# EAGLE design ArduinoUhr1 (EAGLE 9.0.0)
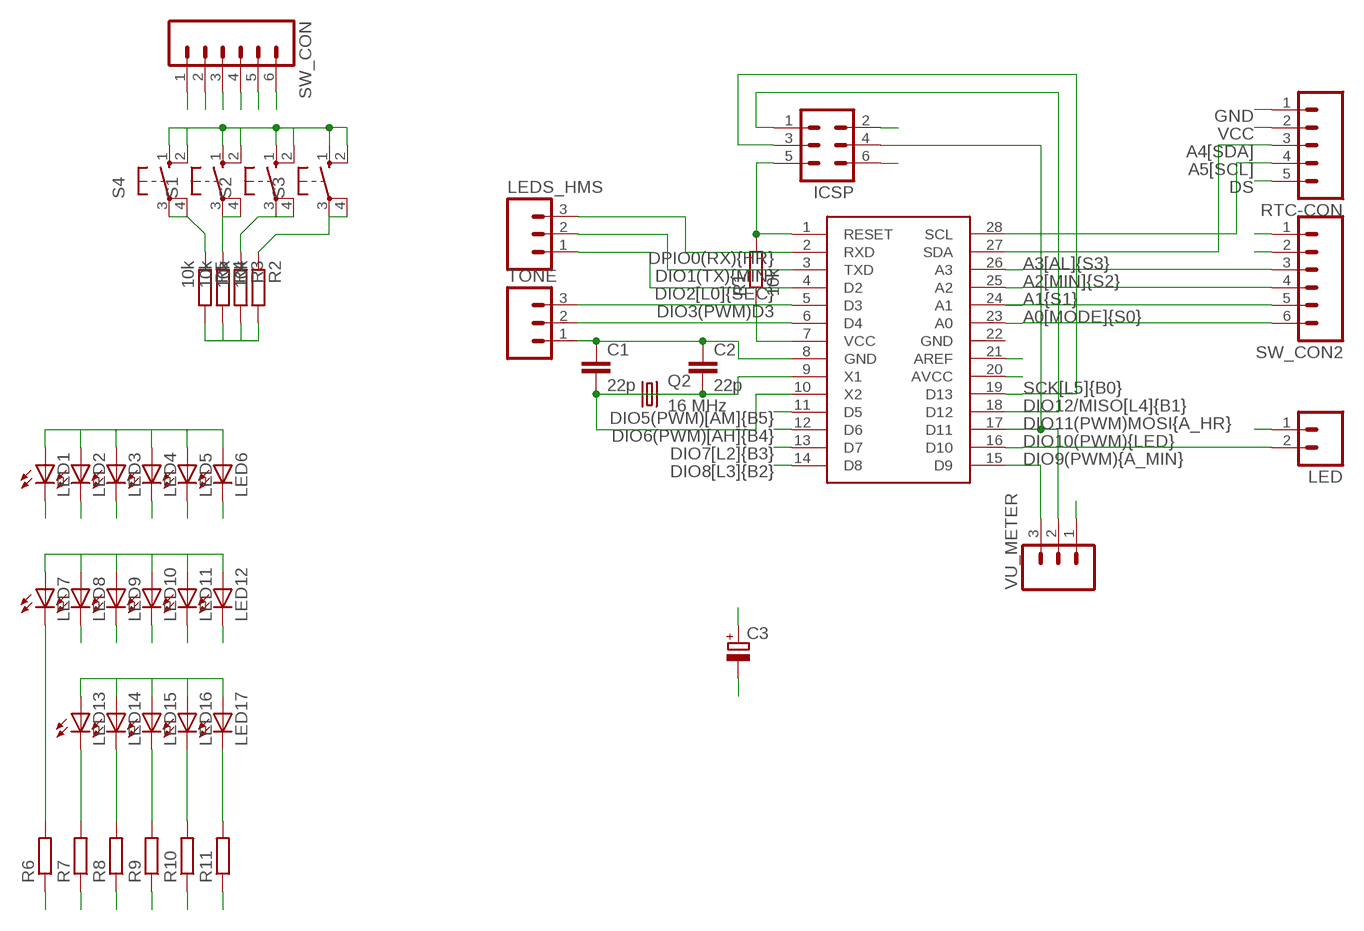
[diagram p0: schematic, sheet 1]

## Parts
C1  22p  C-EU025-024X044  [C025-024X044]
C2  22p  C-EU025-024X044  [C025-024X044]
C3  CPOL-EUE5-10.5  [E5-10,5]
ICSP  MA03-2  [MA03-2]
LED  M02  [02P]
LED1  LED3MM  [LED3MM]
LED2  LED3MM  [LED3MM]
LED3  LED3MM  [LED3MM]
LED4  LED3MM  [LED3MM]
LED5  LED3MM  [LED3MM]
LED6  LED3MM  [LED3MM]
LED7  LED3MM  [LED3MM]
LED8  LED3MM  [LED3MM]
LED9  LED3MM  [LED3MM]
LED10  LED3MM  [LED3MM]
LED11  LED3MM  [LED3MM]
LED12  LED3MM  [LED3MM]
LED13  LED5MM  [LED5MM]
LED14  LED5MM  [LED5MM]
LED15  LED5MM  [LED5MM]
LED16  LED5MM  [LED5MM]
LED17  LED5MM  [LED5MM]
LEDS_HMS  M03  [03P]
Q2  16 MHz  CRYSTALHC49S  [HC49/S]
R1  10k  R-EU_0207/15  [0207/15]
R2  10k  R-EU_0204/5  [0204/5]
R3  10k  R-EU_0204/5  [0204/5]
R4  10k  R-EU_0204/5  [0204/5]
R5  10k  R-EU_0204/5  [0204/5]
R6  R-EU_0204/7  [0204/7]
R7  R-EU_0204/7  [0204/7]
R8  R-EU_0204/7  [0204/7]
R9  R-EU_0204/7  [0204/7]
R10  R-EU_0204/7  [0204/7]
R11  R-EU_0204/7  [0204/7]
RTC-CON  M05  [05P]
S1  40-XX  [B3F-40XX]
S2  40-XX  [B3F-40XX]
S3  40-XX  [B3F-40XX]
S4  40-XX  [B3F-40XX]
SW_CON  M06  [06P]
SW_CON2  M06  [06P]
TONE  M03  [03P]
U$1  ATMEGA328P-PU  [DIL28-3]
VU_METER  M03  [03P]

## Nets
A0[MODE]{S0}: SW_CON2.6 U$1.23(A0)
A1{S1}: SW_CON2.5 U$1.24(A1)
A2[MIN]{S2}: SW_CON2.4 U$1.25(A2)
A3[AL]{S3}: SW_CON2.3 U$1.26(A3)
A4[SDA]: RTC-CON.3 U$1.27(SDA)
A5[SCL]: RTC-CON.4 U$1.28(SCL)
AREF: U$1.21(AREF)
BIT0: R11.1
BIT1: R10.1
BIT2: R9.1
BIT3: R8.1
BIT4: R7.1
BIT5: R6.1
D4: TONE.2 U$1.6(D4)
DIO1(TX){MIN}: LED7.A LED8.A LED9.A LED10.A LED11.A LED12.A LEDS_HMS.2 U$1.3(TXD)
DIO2[L0]{SEC}: LED1.A LED2.A LED3.A LED4.A LED5.A LED6.A LEDS_HMS.1 U$1.4(D2)
DIO3(PWM)D3: TONE.3 U$1.5(D3)
DIO5(PWM)[AM]{B5}: U$1.11(D5)
DIO6(PWM)[AH]{B4}: U$1.12(D6)
DIO7[L2]{B3}: U$1.13(D7)
DIO8[L3]{B2}: U$1.14(D8)
DIO9(PWM){A_MIN}: U$1.15(D9) VU_METER.3
DIO10(PWM){LED}: LED.2 U$1.16(D10)
DIO11(PWM)MOSI{A_HR}: ICSP.4 U$1.17(D11) VU_METER.2
DIO12/MISO[L4]{B1}: ICSP.1 U$1.18(D12)
DPIO0(RX){HR}: LED13.A LED14.A LED15.A LED16.A LED17.A LEDS_HMS.3 U$1.2(RXD)
DS: RTC-CON.5
GND: C1.1 C2.1 C3.- ICSP.6 LED.1 RTC-CON.1 SW_CON2.2 TONE.1 U$1.8(GND) VU_METER.1
GND_SW: R2.2 R3.2 R4.2 R5.2 SW_CON.2
LED0: LED6.K(C) LED12.K(C) LED17.K(C) R11.2
LED1: LED5.K(C) LED11.K(C) LED16.K(C) R10.2
LED2: LED4.K(C) LED10.K(C) LED15.K(C) R9.2
LED3: LED3.K(C) LED9.K(C) LED14.K(C) R8.2
LED4: LED2.K(C) LED8.K(C) LED13.K(C) R7.2
LED5: LED1.K(C) LED7.K(C) R6.2
RESET: ICSP.5 R1.2 U$1.1(RESET)
SCK[L5]{B0}: ICSP.3 U$1.19(D13)
SW1: R5.1 S4.3(P) S4.4(P1) SW_CON.3
SW2: R4.1 S1.3(P) S1.4(P1) SW_CON.4
SW3: R3.1 S2.3(P) S2.4(P1) SW_CON.5
SW4: R2.1 S3.3(P) S3.4(P1) SW_CON.6
VCC: C3.+ ICSP.2 R1.1 RTC-CON.2 SW_CON2.1 U$1.7(VCC) U$1.20(AVCC)
VCC_SW: S1.1(S) S1.2(S1) S2.1(S) S2.2(S1) S3.1(S) S3.2(S1) S4.1(S) S4.2(S1) SW_CON.1
X1: C2.2 Q2.1 U$1.9(X1)
X2: C1.2 Q2.2 U$1.10(X2)
Unconnected: U$1.22(GND)

## Library data of the parts
C1 C2 = rcl:C-EU: CAPACITOR, European symbol
C3 = rcl:CPOL-EU: POLARIZED CAPACITOR, European symbol
ICSP = con-lstb:MA03-2: PIN HEADER; OC_FARNELL: unknown; OC_NEWARK: unknown
LED = con-amp-quick:M02: AMP QUICK CONNECTOR; OC_FARNELL: unknown; OC_NEWARK: unknown
LED1-LED17 = led:LED: LED OSRAM: - CHIPLED LG R971, LG N971, LY N971, LG Q971, LY Q971, LO R971, LY R971 LH N974, LH R974 LS Q976, LO Q976, LY Q976 LO Q996 - Hyper CHIPLED LW Q18S LB Q993, LB Q99A, LB R99A - SideLED LS A670, LO A670, LY A670, LG A670, LP A670 LB A673, LV A673, LT A673, LW A673 LH A674 LY A675 LS A676, LA A676, LO A676, LY A676, LW A676 LS A679, LY A679, LG A679 - Hyper Micro SIDELED® LS Y876, LA Y876, LO Y876, LY Y876 LT Y87S - SmartLED LW L88C, LW L88S LB L89C, LB L89S, LG L890 LS L89K, LO L89K, LY L89K LS L896, LA L896, LO L896, LY L896 - TOPLED LS T670, LO T670, LY T670, LG T670, LP T670 LSG T670, LSP T670, LSY T670, LOP T670, LYG T670 LG T671, LOG T671, LSG T671 LB T673, LV T673, LT T673, LW T673 LH T674 LS T676, LA T676, LO T676, LY T676, LB T676, LH T676, LSB T676, LW T676 LB T67C, LV T67C, LT T67C, LS T67K, LO T67K, LY T67K, LW E67C LS E67B, LA E67B, LO E67B, LY E67B, LB E67C, LV E67C, LT E67C LW T67C LS T679, LY T679, LG T679 LS T770, LO T770, LY T770, LG T770, LP T770 LB T773, LV T773, LT T773, LW T773 LH T774 LS E675, LA E675, LY E675, LS T675 LS T776, LA T776, LO T776, LY T776, LB T776 LHGB T686 LT T68C, LB T68C - Hyper Mini TOPLED® LB M676 - Mini TOPLED Santana® LG M470 LS M47K, LO M47K, LY M47K Source: http://www.osram.convergy.de LUXEON: - LUMILED® LXK2-PW12-R00, LXK2-PW12-S00, LXK2-PW14-U00, LXK2-PW14-V00 LXK2-PM12-R00, LXK2-PM12-S00, LXK2-PM14-U00 LXK2-PE12-Q00, LXK2-PE12-R00, LXK2-PE12-S00, LXK2-PE14-T00, LXK2-PE14-U00 LXK2-PB12-K00, LXK2-PB12-L00, LXK2-PB12-M00, LXK2-PB14-N00, LXK2-PB14-P00, LXK2-PB14-Q00 LXK2-PR12-L00, LXK2-PR12-M00, LXK2-PR14-Q00, LXK2-PR14-R00 LXK2-PD12-Q00, LXK2-PD12-R00, LXK2-PD12-S00 LXK2-PH12-R00, LXK2-PH12-S00 LXK2-PL12-P00, LXK2-PL12-Q00, LXK2-PL12-R00 Source: www.luxeon.com KINGBRIGHT: KA-3528ASYC Source: www.kingbright.com
LEDS_HMS TONE VU_METER = con-amp-quick:M03: AMP QUICK CONNECTOR; OC_FARNELL: unknown; OC_NEWARK: unknown
Q2 = crystal:CRYSTAL: CRYSTAL; OC_FARNELL: 1667008; OC_NEWARK: unknown
R1-R11 = rcl:R-EU_: RESISTOR, European symbol
RTC-CON = con-amp-quick:M05: AMP QUICK CONNECTOR; OC_FARNELL: unknown; OC_NEWARK: unknown
S1-S4 = switch-omron:40-XX: OMRON SWITCH; MF: OMRON COMPONENTS USA; MPN: B3F-4000; OC_FARNELL: 176434; OC_NEWARK: 36K3105
SW_CON SW_CON2 = con-amp-quick:M06: AMP QUICK CONNECTOR; OC_FARNELL: unknown; OC_NEWARK: unknown
U$1 = atmel2:ATMEGA328P-PU

## Board
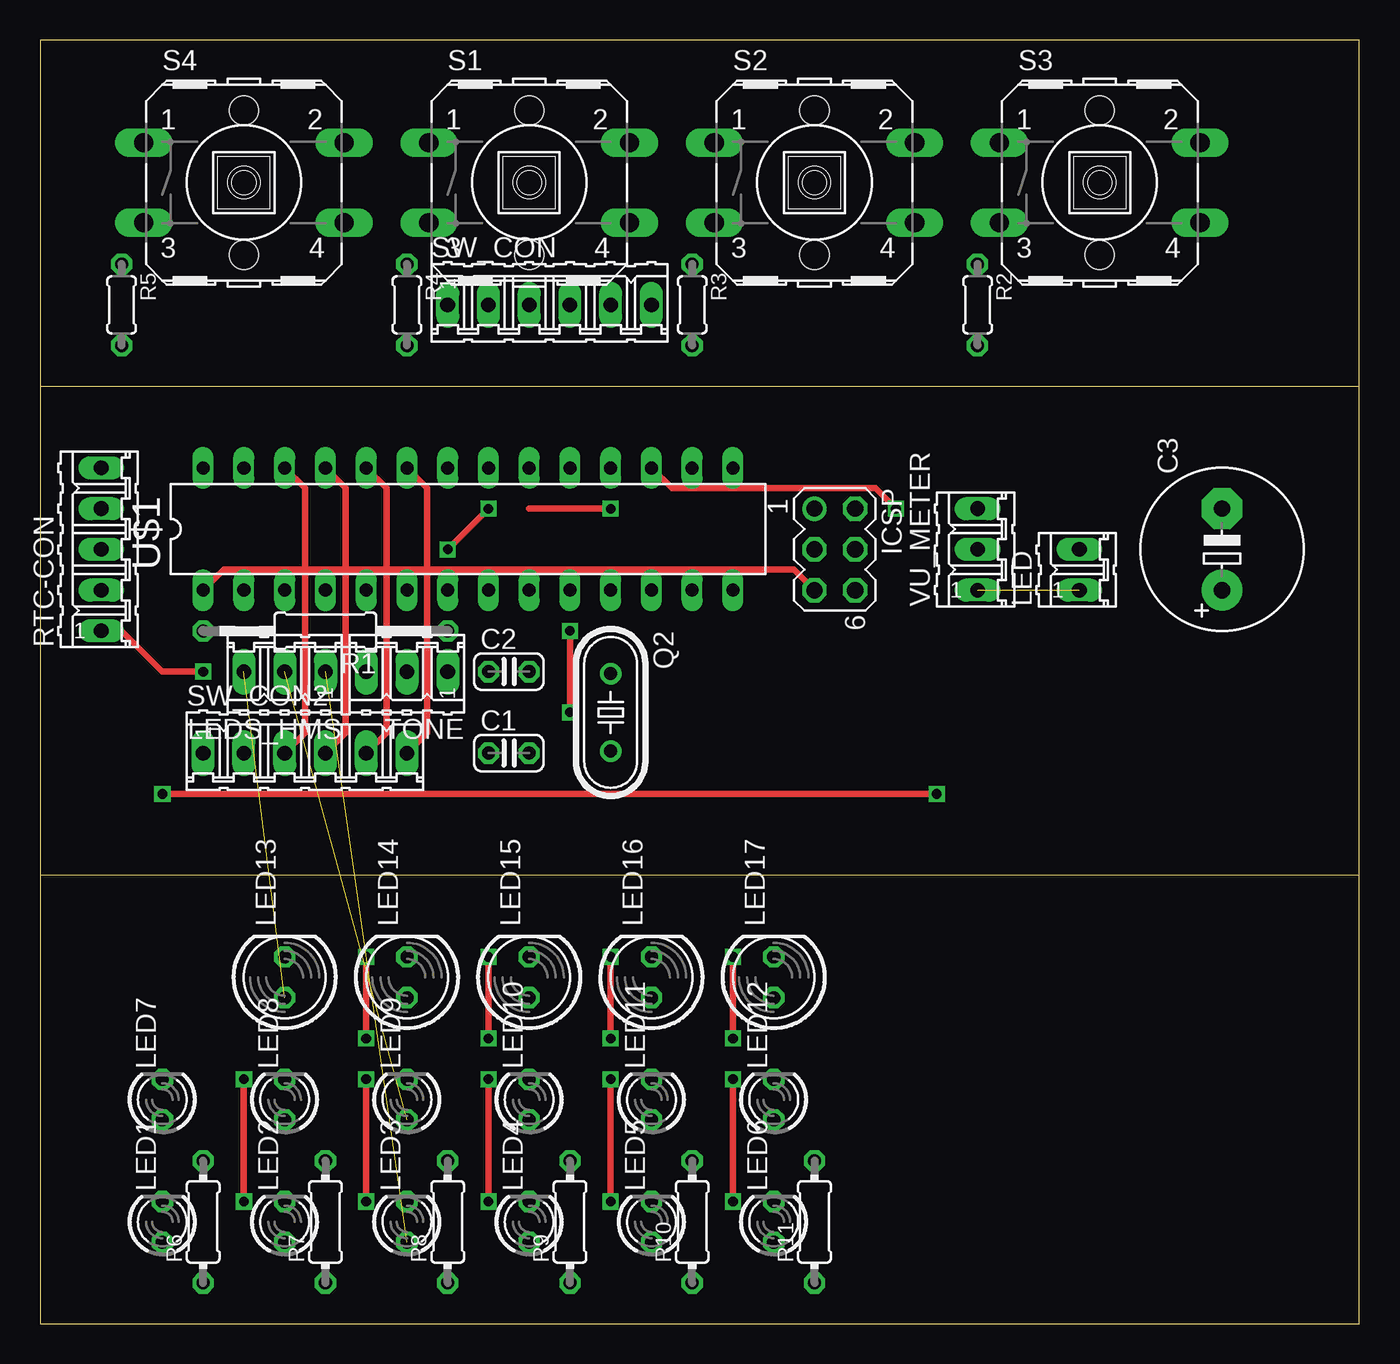
[diagram p1: board, top side]
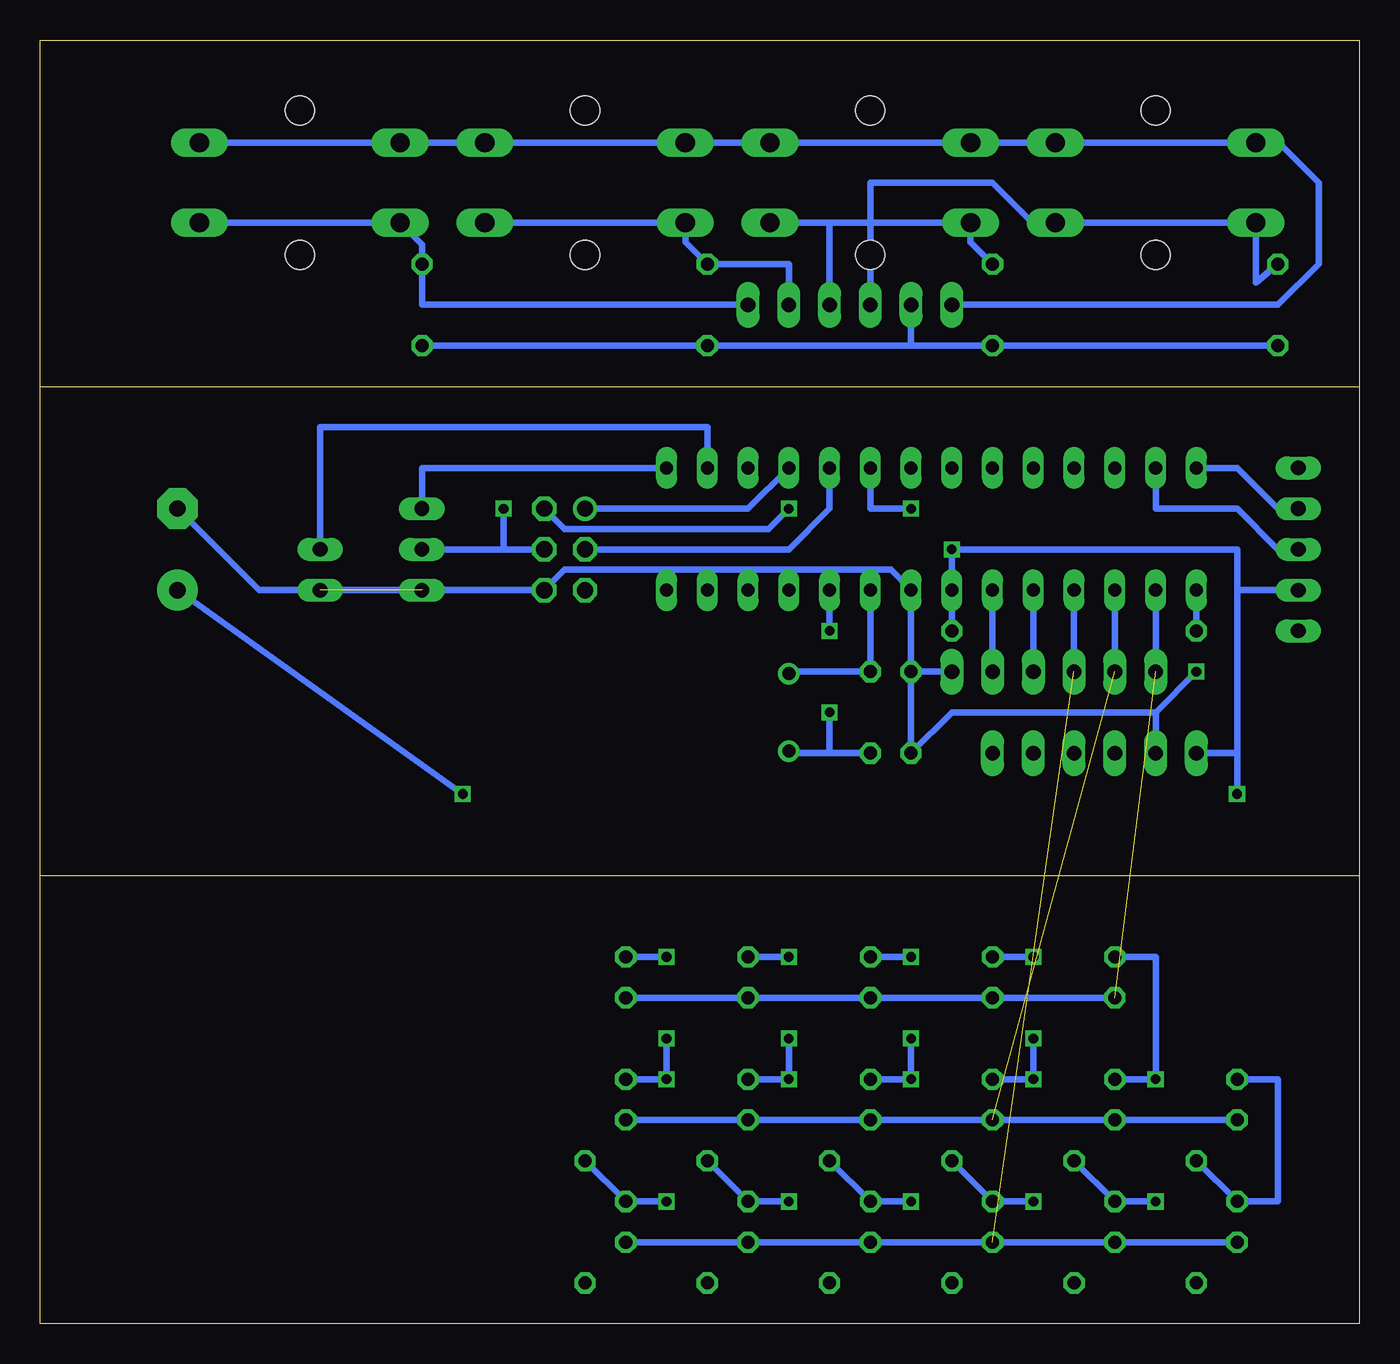
[diagram p2: board, bottom side, seen from below]

Size 82.22 x 80 mm. Coordinates in mm from the lower left corner, seen from the top.
Outline: 82.22,27.93 82.22,0 0,0 0,27.93
Outline: 82.22,27.93 82.22,58.41
Outline: 82.22,58.41 82.22,80 0,80 0,58.41
Outline: 0,58.41 0,27.93
Outline: 82.22,58.41 0,58.41
Outline: 82.22,27.93 0,27.93
Copper layers (1*16): Top 0.035mm / dielectric 1.5mm / Bottom 0.035mm
Design rules "default": minimum track width 10mil, minimum drill 24mil, track to track 8mil, track to pad 8mil, pad to pad 8mil, via to via 8mil, smd to smd 8mil, copper to edge 40mil, drill to drill 8mil, minimum pad ring 10mil, minimum via ring 8mil, stop-mask expansion 4mil, vias tented up to drill 0mil, thermal gap 10mil

### Footprints (pad centres in the part's own frame; a part is rotated, then mirrored left to right if it is on the bottom)
C025-024X044 = drill 0.813 octagon: 1 -1.27,0; 2 1.27,0
E5-10,5 = drill 1.016 pad 2.54: + -2.54,0 | drill 1.016 pad 2.54 octagon: - 2.54,0
MA03-2 = drill 1.016: 1 -2.54,-1.27 | drill 1.016 octagon: 2 -2.54,1.27; 3 0,-1.27; 4 0,1.27; 5 2.54,-1.27; 6 2.54,1.27
02P = drill 0.914 long: 1 -1.27,0; 2 1.27,0
LED3MM = drill 0.813 octagon: A -1.27,0; K 1.27,0
LED5MM = drill 0.813 octagon: A -1.27,0; K 1.27,0
03P = drill 0.914 long: 1 -2.54,0; 2 0,0; 3 2.54,0
HC49/S = drill 0.813: 1 -2.413,0; 2 2.413,0
0207/15 = drill 0.813 octagon: 1 -7.62,0; 2 7.62,0
0204/5 = drill 0.813 octagon: 1 -2.54,0; 2 2.54,0
0204/7 = drill 0.813 octagon: 1 -3.81,0; 2 3.81,0
05P = drill 0.914 long: 1 -5.08,0; 2 -2.54,0; 3 0,0; 4 2.54,0; 5 5.08,0
B3F-40XX = drill 1.194 long: 1 -6.248,2.489; 2 6.248,2.489; 3 -6.248,-2.489; 4 6.248,-2.489 | hole 1.803: 0,-4.496; 0,4.496
06P = drill 0.914 long: 1 -6.35,0; 2 -3.81,0; 3 -1.27,0; 4 1.27,0; 5 3.81,0; 6 6.35,0
DIL28-3 = drill 0.813 long: 1 -16.51,-3.81; 2 -13.97,-3.81; 3 -11.43,-3.81; 4 -8.89,-3.81; 5 -6.35,-3.81; 6 -3.81,-3.81; 7 -1.27,-3.81; 8 1.27,-3.81; 9 3.81,-3.81; 10 6.35,-3.81; 11 8.89,-3.81; 12 11.43,-3.81; 13 13.97,-3.81; 14 16.51,-3.81; 15 16.51,3.81; 16 13.97,3.81; 17 11.43,3.81; 18 8.89,3.81; 19 6.35,3.81; 20 3.81,3.81; 21 1.27,3.81; 22 -1.27,3.81; 23 -3.81,3.81; 24 -6.35,3.81; 25 -8.89,3.81; 26 -11.43,3.81; 27 -13.97,3.81; 28 -16.51,3.81

### Placement (x,y rotation side)
C1  29.21,35.56 0 top
C2  29.21,40.64 0 top
C3  73.66,48.26 90 top
ICSP  49.53,48.26 270 top
LED  64.77,46.99 90 top
LED1  7.62,6.35 90 top
LED2  15.24,6.35 90 top
LED3  22.86,6.35 90 top
LED4  30.48,6.35 90 top
LED5  38.1,6.35 90 top
LED6  45.72,6.35 90 top
LED7  7.62,13.97 90 top
LED8  15.24,13.97 90 top
LED9  22.86,13.97 90 top
LED10  30.48,13.97 90 top
LED11  38.1,13.97 90 top
LED12  45.72,13.97 90 top
LED13  15.24,21.59 90 top
LED14  22.86,21.59 90 top
LED15  30.48,21.59 90 top
LED16  38.1,21.59 90 top
LED17  45.72,21.59 90 top
LEDS_HMS  15.24,40.64 180 top
Q2  35.56,38.1 270 top
R1  17.78,43.18 180 top
R2  58.42,63.5 270 top
R3  40.64,63.5 270 top
R4  22.86,63.5 270 top
R5  5.08,63.5 270 top
R6  10.16,6.35 90 top
R7  17.78,6.35 90 top
R8  25.4,6.35 90 top
R9  33.02,6.35 90 top
R10  40.64,6.35 90 top
R11  48.26,6.35 90 top
RTC-CON  3.81,48.26 90 top
S1  30.48,71.12 0 top
S2  48.26,71.12 0 top
S3  66.04,71.12 0 top
S4  12.7,71.12 0 top
SW_CON  31.75,63.5 0 top
SW_CON2  16.51,35.56 0 top
TONE  22.86,40.64 180 top
U$1  26.67,49.53 0 top
VU_METER  58.42,48.26 90 top

### Tracks (layer width: path | path; a pad name or v marks a point on that pad's centre or on a via)
A0[MODE]{S0}
  Top 0.406: U$1.23 24.13,52.07 24.13,36.83 SW_CON2.6
A1{S1}
  Top 0.406: U$1.24 21.59,52.07 21.59,36.83 SW_CON2.5
A2[MIN]{S2}
  Top 0.406: U$1.25 19.05,52.07 19.05,36.83 SW_CON2.4
A3[AL]{S3}
  Top 0.406: U$1.26 16.51,52.07 16.51,36.83 SW_CON2.3
A4[SDA]
  Bottom 0.406: RTC-CON.3 5.08,48.26 7.62,50.8 12.7,50.8 U$1.27
A5[SCL]
  Bottom 0.406: RTC-CON.4 5.08,50.8 7.62,53.34 U$1.28
D4
  Bottom 0.406: U$1.6 TONE.2
DIO1(TX){MIN}  (1 unrouted)
  Bottom 0.406: U$1.3 LEDS_HMS.2 | LED7.A LED8.A LED9.A LED10.A LED11.A LED12.A
DIO2[L0]{SEC}  (1 unrouted)
  Bottom 0.406: U$1.4 LEDS_HMS.1 | LED1.A LED2.A LED3.A LED4.A LED5.A LED6.A
DIO3(PWM)D3
  Bottom 0.406: U$1.5 TONE.3
DIO9(PWM){A_MIN}
  Bottom 0.406: VU_METER.3 58.42,53.34 U$1.15
DIO10(PWM){LED}
  Bottom 0.406: LED.2 64.77,55.88 40.64,55.88 U$1.16
DIO11(PWM)MOSI{A_HR}  (via drill 0.6)
  Top 0.406: v53.34,50.8 52.07,52.07 39.37,52.07 U$1.17
  Bottom 0.406: v53.34,50.8 53.34,48.26 | 53.34,48.26 ICSP.4 | VU_METER.2 53.34,48.26
DIO12/MISO[L4]{B1}
  Bottom 0.406: ICSP.1 38.1,50.8 U$1.18
DPIO0(RX){HR}  (1 unrouted)
  Bottom 0.406: U$1.2 LEDS_HMS.3 | LED13.A LED14.A LED15.A LED16.A LED17.A
GND  (via drill 0.6)  (1 unrouted)
  Top 0.406: RTC-CON.1 5.08,43.18 7.62,40.64 v10.16,40.64
  Bottom 0.406: C2.1 U$1.8 29.21,46.99 49.53,46.99 ICSP.6 LED.1 68.58,45.72 C3.- | C2.1 C1.1 25.4,38.1 12.7,38.1 | SW_CON2.2 12.7,38.1 | 12.7,38.1 v10.16,40.64 | TONE.1 C2.1
GND_SW
  Bottom 0.406: R5.2 R4.2 27.94,60.96 | SW_CON.2 27.94,60.96 | 27.94,60.96 R3.2 R2.2
LED0  (via drill 0.6)
  Top 0.406: v43.18,7.62 v43.18,15.24 | v43.18,17.78 v43.18,22.86
  Bottom 0.406: v43.18,7.62 LED6.K R11.2 | LED12.K v43.18,15.24 v43.18,17.78 | v43.18,22.86 LED17.K
LED1  (via drill 0.6)
  Top 0.406: v35.56,7.62 v35.56,15.24 | v35.56,17.78 v35.56,22.86
  Bottom 0.406: v35.56,7.62 LED5.K R10.2 | LED11.K v35.56,15.24 v35.56,17.78 | v35.56,22.86 LED16.K
LED2  (via drill 0.6)
  Top 0.406: v27.94,7.62 v27.94,15.24 | v27.94,17.78 v27.94,22.86
  Bottom 0.406: v27.94,7.62 LED4.K R9.2 | LED10.K v27.94,15.24 v27.94,17.78 | v27.94,22.86 LED15.K
LED3  (via drill 0.6)
  Top 0.406: v20.32,7.62 v20.32,15.24 | v20.32,17.78 v20.32,22.86
  Bottom 0.406: v20.32,7.62 LED3.K R8.2 | LED9.K v20.32,15.24 v20.32,17.78 | v20.32,22.86 LED14.K
LED4  (via drill 0.6)
  Top 0.406: v12.7,7.62 v12.7,15.24
  Bottom 0.406: v12.7,7.62 LED2.K R7.2 | LED8.K v12.7,15.24 12.7,22.86 LED13.K
LED5
  Bottom 0.406: LED7.K 5.08,15.24 5.08,7.62 LED1.K R6.2
RESET
  Top 0.406: ICSP.5 46.99,46.99 11.43,46.99 U$1.1
  Bottom 0.406: U$1.1 R1.2
SCK[L5]{B0}
  Bottom 0.406: ICSP.3 35.56,48.26 33.02,50.8 U$1.19
SW1
  Bottom 0.406: R5.1 6.45,64.87 S4.3 S4.4 20.37,68.63 22.86,71.12 30.48,71.12 SW_CON.3
SW2
  Bottom 0.406: R4.1 24.23,67.41 S1.3 33.02,68.63 33.02,68.58 | S1.4 33.07,68.63 33.02,68.58 | 33.02,68.58 SW_CON.4
SW3
  Bottom 0.406: SW_CON.5 35.56,66.04 R3.1 42.01,67.41 S2.3 S2.4
SW4
  Bottom 0.406: S3.4 S3.3 58.42,67.26 R2.1 58.42,63.5 SW_CON.6
VCC  (via drill 0.6)  (1 unrouted)
  Top 0.406: v25.4,48.26 v27.94,50.8 | v35.56,50.8 30.48,50.8 | v55.88,33.02 v7.62,33.02
  Bottom 0.406: v27.94,50.8 30.48,50.8 U$1.20 | ICSP.2 49.53,49.53 36.83,49.53 v35.56,50.8 | R1.1 U$1.7 v25.4,48.26 7.62,48.26 7.62,45.72 | SW_CON2.1 7.62,35.56 | 7.62,35.56 7.62,45.72 | RTC-CON.2 7.62,45.72 | C3.+ v55.88,33.02 | v7.62,33.02 7.62,35.56
VCC_SW
  Bottom 0.406: S4.1 7.62,73.61 | 7.62,73.61 17.73,73.61 17.78,73.66 18.9,73.66 S4.2 S1.1 S1.2 S2.1 S2.2 S3.1 S3.2 | SW_CON.1 5.08,63.5 2.54,66.04 2.54,71.12 5.08,73.66 7.57,73.66 7.62,73.61
X1
  Bottom 0.406: U$1.9 C2.2 35.56,40.64 Q2.1
X2  (via drill 0.6)
  Top 0.406: v33.02,43.18 v33.02,38.1
  Bottom 0.406: C1.2 33.02,35.56 | 33.02,35.56 35.56,35.56 Q2.2 | U$1.10 v33.02,43.18 | v33.02,38.1 33.02,35.56